# Altium schematic sheet Power.SchDoc
size A4; SheetNumber: 2; SheetTotal: 5; SPICEModelCacheCCCFIGUR: <root> / <DocumentId>CCCFIGUR</DocumentId> / <CacheFrame Number="0"> / <Model Name="led0" Kind="MDL"> / <Text>*Typ INFRARED GaAs LED: Vf=1.2V Vr=5V If=40mA trr=3uS / *LED Pinout: 1=A, 2=K / .MODEL LED0 D (IS=93.5P RS=84M N=2.63 BV=5 IBV=10U / + CJO=2.97P VJ=.75 M=.333 TT=4.32U)</Text> / </Model> / </CacheFrame> / </root>
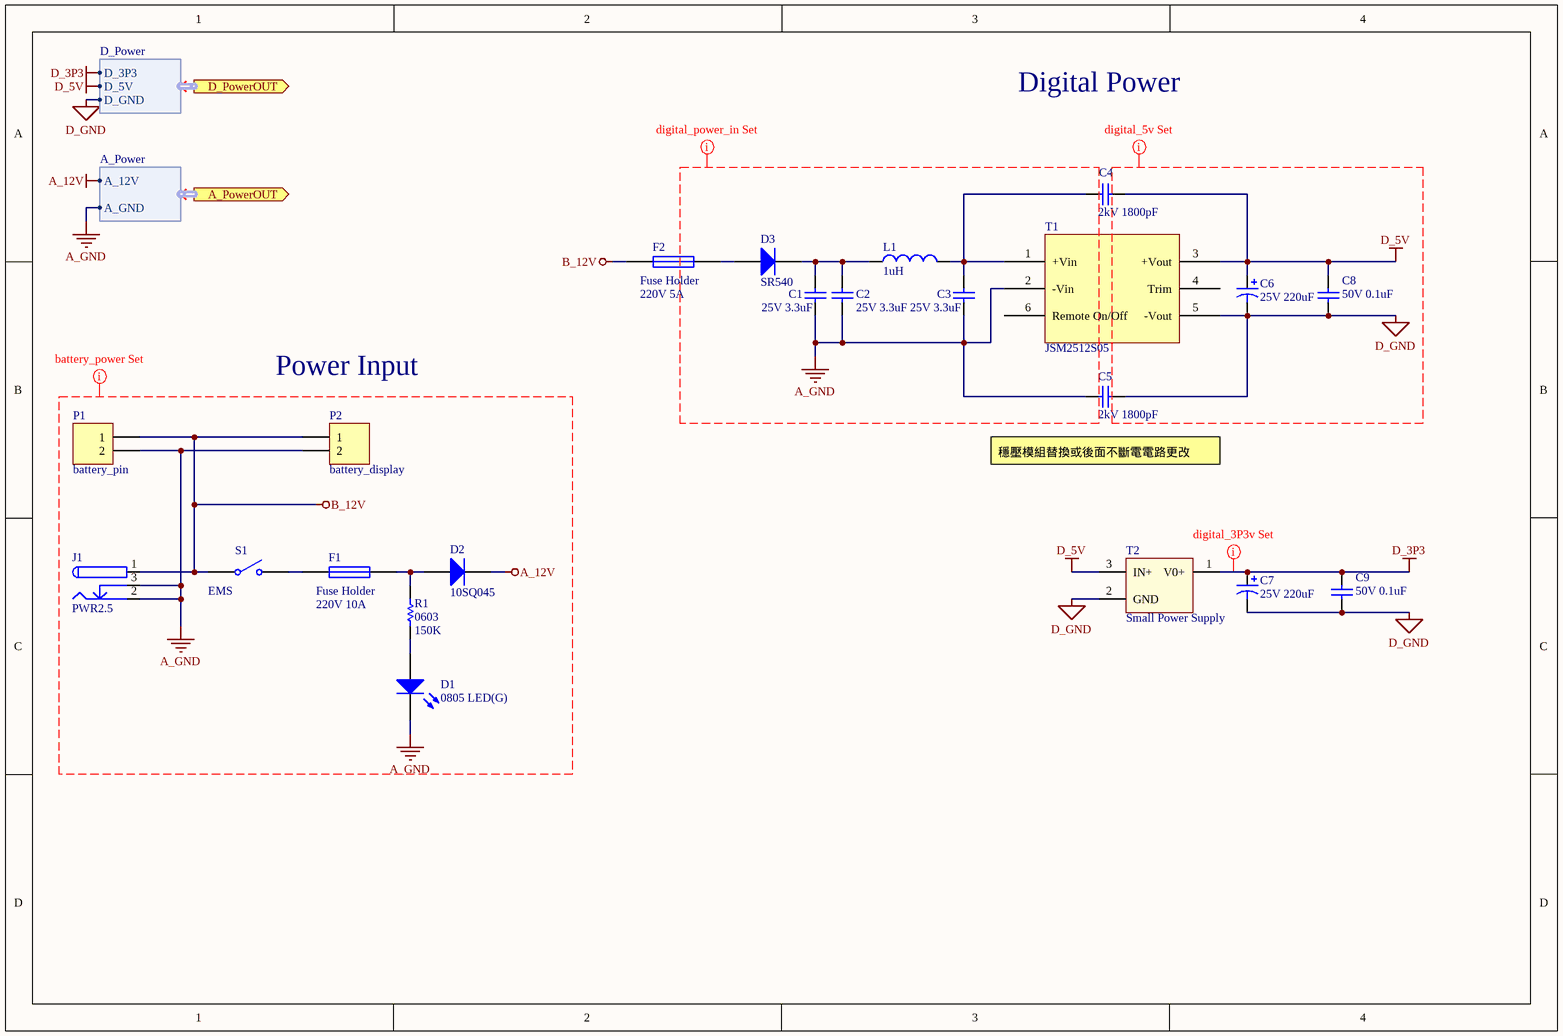
[diagram p0: Power.SchDoc]

## Parts
C1  25V 3.3uF  [1210 SMD]
C2  25V 3.3uF  [1210 SMD]
C3  25V 3.3uF  [1210 SMD]
C4  2kV 1800pF  [1206 SMD]
C5  2kV 1800pF  [1206 SMD]
C6  25V 220uF  [RB4-8]
C7  25V 220uF  [RB4-8]
C8  50V 0.1uF  [C1206]
C9  50V 0.1uF  [C1206]
D1  0805 LED(G)  [0805 SMD DIode]
D2  10SQ045  [10SQ045]
D3  SR540  [SR540]
F1  Fuse Holder  value 220V 10A  [SMD Fuses Holder]
F2  Fuse Holder  value 220V 5A  [SMD Fuses Holder]
J1  PWR2.5  [PWD2.5]
L1  1uH  [DFE2HCAH1R0MJ0L]
P1  battery_pin  [KF2EDGR-5.08 2P]
P2  battery_display  [B2B-XH-A]
R1  0603  value 150K  [0603 SMD Res]
S1  EMS  [4.8插片]
T1  JSM2512S05  [JSM2524S05]
T2  Small Power Supply  [Samll Power Supply]

## Ports
A_PowerOUT (out, harness A_Power), D_PowerOUT (out, harness D_Power)

## Harnesses
D_Power: D_3P3, D_5V, D_GND
A_Power: A_12V, A_GND

## Nets
A_12V: D2.2(K) ; port A_PowerOUT.A_12V
A_GND: C1.2 C2.2 C3.2 C5.1 D1.2(K) J1.2 J1.3 P1.2 P2.2 T1.2(-Vin) ; port A_PowerOUT.A_GND
B_12V: F2.1 J1.1 P1.1 P2.1 S1.1(COMMON)
D_3P3: C7.1 C9.2 T2.1(V0+) ; port D_PowerOUT.D_3P3
D_5V: C4.2 C6.1 C8.2 T1.3(+Vout) T2.3(IN+) ; port D_PowerOUT.D_5V
D_GND: C5.2 C6.2 C7.2 C8.1 C9.1 T1.5(-Vout) T2.2(GND) ; port D_PowerOUT.D_GND
NetC1_1: C1.1 C2.1 D3.2(K) L1.1
NetC3_1: C3.1 C4.1 L1.2 T1.1(+Vin)
NetD1_1: D1.1(A) R1.1
NetD2_1: D2.1(A) F1.2 R1.2
NetD3_1: D3.1(A) F2.2
NetF1_1: F1.1 S1.2(NO)

Not connected (* = marked no-connect by the designer): T1 4(Trim) 6(Remote_On/Off)

## Layout directives
net class battery_power; rule Clearance Constraint [Generic clearance = 0.65mm, and 9 value(s) for objects]; rule Width Constraint [Pref Width = 1.67mm    Min Width = 0.254mm    Max Width = 2mm]; rule Routing Via Style [Pref Size = 1.67mm    Pref Hole Size = 0.9mm]: A_12V, A_GND, B_12V
net class digital_power_in; rule Clearance Constraint [Generic clearance = 0.65mm, and 9 value(s) for objects]; rule Width Constraint [Pref Width = 0.29mm    Min Width = 0.254mm    Max Width = 0.31mm]; rule Routing Via Style [Pref Size = 20mil    Pref Hole Size = 10mil]: A_GND
net class digital_5v; rule Clearance Constraint [Generic clearance = 0.61mm, and 9 value(s) for objects]; rule Width Constraint [Pref Width = 0.8mm    Min Width = 0.254mm    Max Width = 1mm]; rule Routing Via Style [Pref Size = 50mil    Pref Hole Size = 28mil]: D_5V, D_GND
net class digital_3P3v; rule Clearance Constraint [Generic clearance = 0.6mm, and 9 value(s) for objects]; rule Width Constraint [Pref Width = 0.254mm    Min Width = 0.254mm    Max Width = 0.381mm]; rule Routing Via Style [Pref Size = 20mil    Pref Hole Size = 10mil]: D_3P3

## Notes on the sheet
- Digital Power
- Power Input
- (near C5) 穩壓模組替換或後面不斷電電路更改

## Library data of the parts
C1-C3 = Cap: 50V 3.3uF 1210 MLCC; Published: 8-Jun-2000; LatestRevisionDate: 17-Jul-2002; LatestRevisionNote: Re-released for DXP Platform.; PackageReference: RAD-0.3; Publisher: Altium Limited; PackageDescription: Radial Cap, Thru-Hole; 2 Leads; 0.3 in Pin Spacing; Value: 3.3uF
C4 C5 = Cap: Capacitor; Published: 8-Jun-2000; LatestRevisionDate: 17-Jul-2002; LatestRevisionNote: Re-released for DXP Platform.; PackageReference: RAD-0.3; Publisher: Altium Limited; PackageDescription: Radial Cap, Thru-Hole; 2 Leads; 0.3 in Pin Spacing; Value: 1800pF
C6 C7 = Cap Pol1: DIP cap; Value: 1000uF; Published: 8-Jun-2000; LatestRevisionDate: 17-Jul-2002; LatestRevisionNote: Re-released for DXP Platform.; PackageReference: RB7.6-15; Publisher: Altium Limited; PackageDescription: Polarized Capacitor (Radial); 2 Leads; ComponentLink1Description: buy_link; ComponentLink1URL: https://shopee.tw/(%E5%85%83%E8%80%80)-%E7%9B%B4%E6%8F%92-%E9%9B%BB%E8%A7%A3%E9%9B%BB%E5%AE%B9-47uF~1000uF-16V~50V-%E9%AB%94%E7%A9%8D-8*14.5mm~10*19.5mm(5%E9%A1%86%E4%B8%80%E6%A8%99)-i.140576581.2524079905?sp_atk=ccd45567-e386-4bfb-a6e8-2480335a57a5
C8 C9 = Cap Semi: 0805F105Z250CT; Value: 1uF; Published: 8-Jun-2000; LatestRevisionDate: 29-May-2009; LatestRevisionNote: IPC-7351 Footprint Added.; PackageReference: C1206; Publisher: Altium Limited; PackageDescription: Chip Capacitor
D1 = LED0: Typical INFRARED GaAs LED; Published: 8-Jun-2000; LatestRevisionDate: 08-Jul-2005; LatestRevisionNote: Mech Layer 1 removed.; PackageReference: LED-0; Publisher: Altium Limited; PackageDescription: LED; 2 Leads
D2 D3 = Diode: Default Diode; Published: 8-Jun-2000; LatestRevisionDate: 17-Jul-2002; LatestRevisionNote: Re-released for DXP Platform.; PackageVersion: Sep-1996; PackageReference: SMC; Publisher: Altium Limited; PackageDescription: DO-214-AB/SMC; 2 C-Bend Leads; Body 7.9 x 5.9 mm, inc. leads (LxW); Code_JEDEC: DO-214-AB
F1 = Fuse 1: 0451010.MRL; Published: 8-Jun-2000; LatestRevisionDate: 17-Jul-2002; LatestRevisionNote: Re-released for DXP Platform.; PackageReference: PIN-W2/E2.8; Publisher: Altium Limited; PackageDescription: Thru-Hole; 2 Leads
F2 = Fuse 1: 0451005.MRL; Published: 8-Jun-2000; LatestRevisionDate: 17-Jul-2002; LatestRevisionNote: Re-released for DXP Platform.; PackageReference: PIN-W2/E2.8; Publisher: Altium Limited; PackageDescription: Thru-Hole; 2 Leads
J1 = PWR2.5: Low Voltage Power Supply Connector; Published: 17-Dec-2003; DatasheetDocument: 09-May-2002; Publisher: Altium Limited; ComponentLink1Description: Manufacturer Link; ComponentLink1URL: http://domino.kycon.com/internet/Products.html
L1 = Inductor: 1uH 3A 1008 SMD lnductor; Code_IEC: 1005; Value: 2.2uH; Published: 8-Jun-2000; LatestRevisionDate: 29-May-2009; LatestRevisionNote: IPC-7351 Footprint Added.; PackageReference: 0402-A; Publisher: Altium Limited; PackageDescription: Chip Inductor; Code_JEITA: 0402
P1 = Header 2: KF2EDGR-5.08 2P; LatestRevisionDate: 17-Jul-2002; LatestRevisionNote: Re-released for DXP Platform.; Publisher: Altium Limited
P2 = Header 2: B2B-XH-A; LatestRevisionDate: 17-Jul-2002; LatestRevisionNote: Re-released for DXP Platform.; Publisher: Altium Limited
R1 = Res1: Resistor; Published: 8-Jun-2000; LatestRevisionDate: 17-Jul-2002; LatestRevisionNote: Re-released for DXP Platform.; PackageReference: AXIAL-0.3; Publisher: Altium Limited; PackageDescription: Axial Device, Thru-Hole; 2 Leads; 0.3 in Pin Spacing
S1 = SW-SPST: Published: 24-Mar-1999; LatestRevisionDate: 17-Jul-2002; LatestRevisionNote: Re-released for DXP Platform.; PackageReference: SPST-2; Publisher: Altium Limited; PackageDescription: Switch; 2 Leads
T1 = JSM2524S05: JSM2524S05 Isolation DC-DC converter
T2 = PowerSupply 3P: BuyLink: https://www.ruten.com.tw/item/show?21817939184609